# EAGLE schematic charger_v4 (EAGLE 9.6.1)
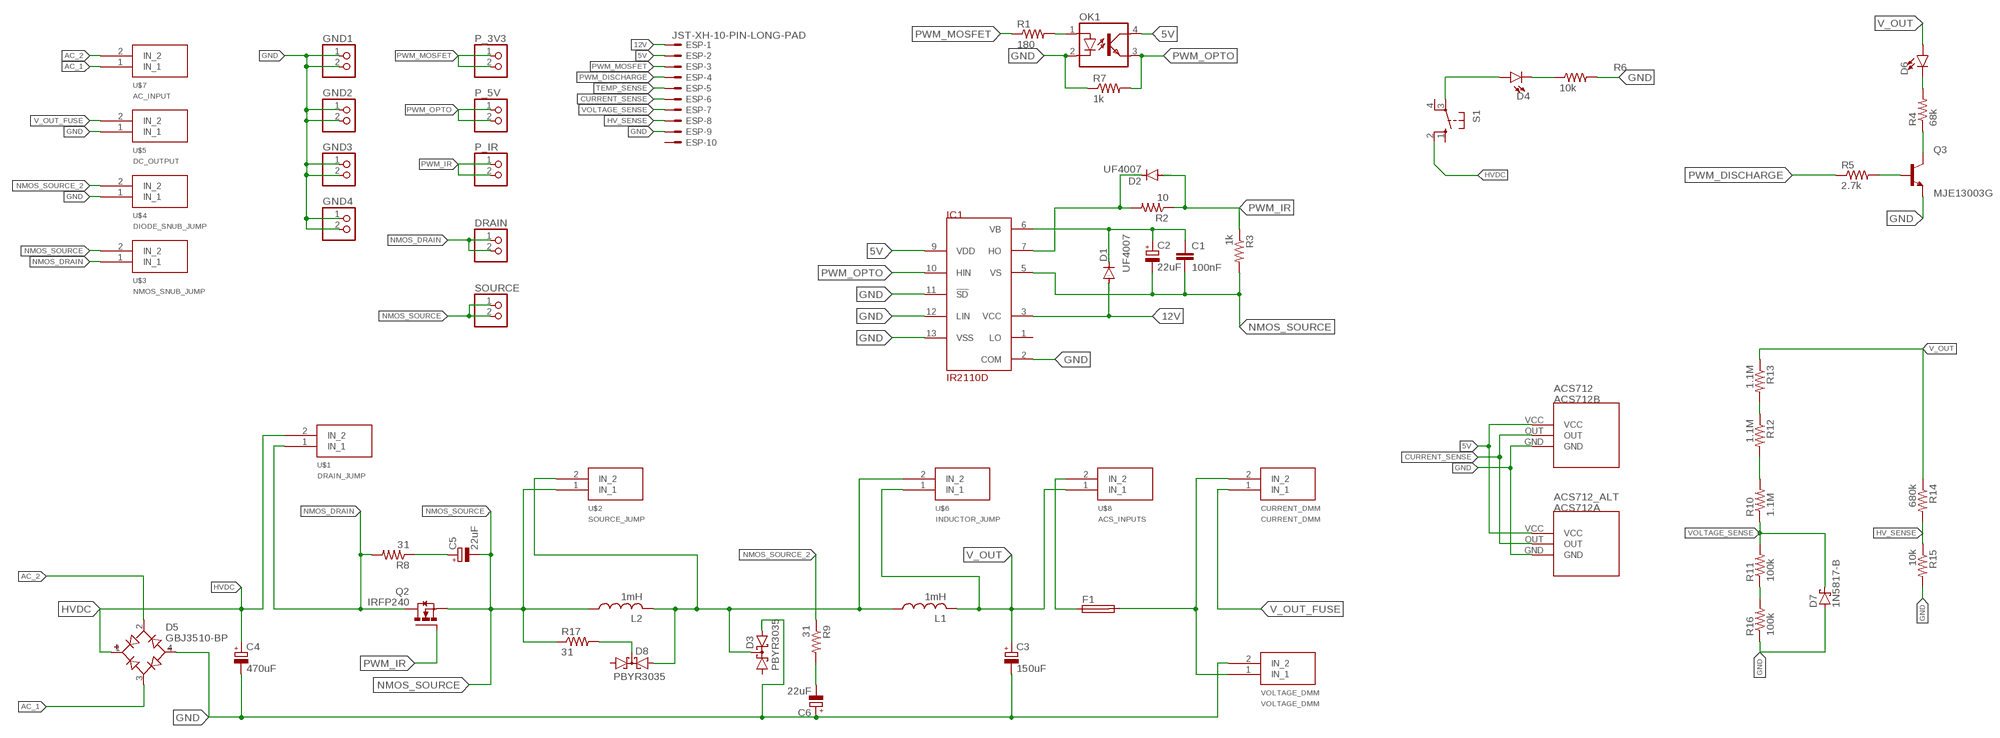
[diagram p0: schematic, sheet 1]

## Parts
ACS712  ACS712B  [ACS712-2]
ACS712_ALT  ACS712A  [ACS712-1]
C1  100nF  C-EU025-025X050  [C025-025X050]
C2  22uF  CPOL-EUE2,5-6E  [E2,5-6E]
C3  150uF  CPOL-EUE7.5-18  [E7,5-18]
C4  470uF  CPOL-EUE10-35  [EB35D]
C5  22uF  CPOL-EUETR4  [ETR4]
C6  22uF  CPOL-EUETR4  [ETR4]
CURRENT_DMM  CURRENT_DMM  TERMINAL_2P  [TERMINAL_2P]
D1  UF4007  BAS15  [DO34-7]
D2  UF4007  BAS15  [DO34-7]
D3  PBYR3035  [SOT93S]
D4  LED5MM  [LED_5MM]
D5  GBJ3510-BP  [DIOB_GBJ3510-BP]
D6  LED5MM  [LED_5MM]
D7  1N5817-B  [DO41-7.6]
D8  PBYR3035  [SOT93S]
DRAIN  PINHD-1X2  [1X02]
ESP  JST-XH-10-PIN-LONG-PAD  [JST-XH-10-PACKAGE-LONG-PAD]
F1  FUSEHOLDER  [FUSEHOLDER]
GND1  PINHD-1X2  [1X02]
GND2  PINHD-1X2  [1X02]
GND3  PINHD-1X2  [1X02]
GND4  PINHD-1X2  [1X02]
IC1  IR2110D  [DIL14]
L1  1mH  L-USTJ7-U1  [TJ7-U1]
L2  1mH  L-USTJ7-U1  [TJ7-U1]
OK1  SFH618A-5  [DIP4]
P_3V3  PINHD-1X2  [1X02]
P_5V  PINHD-1X2  [1X02]
P_IR  PINHD-1X2  [1X02]
Q2  IRFP240  [TO247AC]
Q3  MJE13003G  [TO229P780X300X1364-3]
R1  180  R-US_0204/7  [0204/7]
R2  10  R-US_0204/7  [0204/7]
R3  1k  R-US_0204/7  [0204/7]
R4  68k  R-US_0411/15  [0411/15]
R5  2.7k  R-US_0204/7  [0204/7]
R6  10k  R-US_0204/7  [0204/7]
R7  1k  R-US_0204/7  [0204/7]
R8  31  R-US_0411/15  [0411/15]
R9  31  R-US_0411/15  [0411/15]
R10  1.1M  R-US_R0805  [R0805]
R11  100k  R-US_R0805  [R0805]
R12  1.1M  R-US_R0805  [R0805]
R13  1.1M  R-US_R0805  [R0805]
R14  680k  R-US_0207/10  [0207/10]
R15  10k  R-US_0207/10  [0207/10]
R16  100k  R-US_R0805  [R0805]
R17  31  R-US_0411/15  [0411/15]
S1  10-XX  [B3F-10XX]
SOURCE  PINHD-1X2  [1X02]
U$1  DRAIN_JUMP  TERMINAL_2P  [TERMINAL_2P]
U$2  SOURCE_JUMP  TERMINAL_2P  [TERMINAL_2P]
U$3  NMOS_SNUB_JUMP  TERMINAL_2P  [TERMINAL_2P]
U$4  DIODE_SNUB_JUMP  TERMINAL_2P  [TERMINAL_2P]
U$5  DC_OUTPUT  TERMINAL_2P  [TERMINAL_2P]
U$6  INDUCTOR_JUMP  TERMINAL_2P  [TERMINAL_2P]
U$7  AC_INPUT  TERMINAL_2P  [TERMINAL_2P]
U$8  ACS_INPUTS  TERMINAL_2P  [TERMINAL_2P]
VOLTAGE_DMM  VOLTAGE_DMM  TERMINAL_2P  [TERMINAL_2P]

## Nets
5V: ACS712.VCC ACS712_ALT.VCC ESP.2 IC1.9(VDD) OK1.4(COL)
12V: D1.A ESP.1 IC1.3(VCC)
AC_1: D5.3(AC2) U$7.1(IN_1)
AC_2: D5.2(AC1) U$7.2(IN_2)
CURRENT_SENSE: ACS712.OUT ACS712_ALT.OUT ESP.6
GND: ACS712.GND ACS712_ALT.GND C3.- C4.- C6.+ D3.A2 D5.4(-) D7.A ESP.9 GND1.1 GND1.2 GND2.1 GND2.2 GND3.1 GND3.2 GND4.1 GND4.2 IC1.2(COM) IC1.11(!SD) IC1.12(LIN) IC1.13(VSS) OK1.2(C) Q3.3(E) R6.2 R7.1 R15.2 R16.1 U$4.1(IN_1) U$5.1(IN_1) VOLTAGE_DMM.2(IN_2)
HV_SENSE: ESP.8 R14.2 R15.1
HVDC: C4.+ D5.1(+) S1.2(S1) U$1.2(IN_2)
N$1: D2.C IC1.7(HO) R2.2
N$2: D4.A S1.3(P)
N$3: Q3.2(C) R4.1
N$4: D6.K(C) R4.2
N$5: Q3.1(B) R5.2
N$6: C5.+ R8.1
N$7: C6.- R9.2
N$8: D4.K(C) R6.1
N$9: OK1.1(A) R1.2
N$10: D8.C R17.2
N$11: CURRENT_DMM.2(IN_2) F1.2 VOLTAGE_DMM.1(IN_1)
N$12: R10.2 R12.2
N$13: R12.1 R13.2
N$14: R11.1 R16.2
N$15: F1.1 U$8.2(IN_2)
NMOS_DRAIN: DRAIN.1 DRAIN.2 Q2.2(D) R8.2 U$1.1(IN_1) U$3.1(IN_1)
NMOS_SOURCE: C1.2 C2.- C5.- IC1.5(VS) L2.1 Q2.3(S) R3.2 R17.1 SOURCE.1 SOURCE.2 U$2.1(IN_1) U$3.2(IN_2)
NMOS_SOURCE_2: D3.C D8.A2 L1.1 L2.2 R9.1 U$2.2(IN_2) U$4.2(IN_2) U$6.2(IN_2)
PWM_DISCHARGE: ESP.4 R5.1
PWM_IR: D2.A P_IR.1 P_IR.2 Q2.1(G) R2.1 R3.1
PWM_MOSFET: ESP.3 P_3V3.1 P_3V3.2 R1.1
PWM_OPTO: IC1.10(HIN) OK1.3(EMIT) P_5V.1 P_5V.2 R7.2
TEMP_SENSE: ESP.5
V_OUT: C3.+ D6.A L1.2 R13.1 R14.1 U$6.1(IN_1) U$8.1(IN_1)
V_OUT_FUSE: CURRENT_DMM.1(IN_1) U$5.2(IN_2)
VB: C1.1 C2.+ D1.C IC1.6(VB)
VOLTAGE_SENSE: D7.C ESP.7 R10.1 R11.2
Unconnected: D3.A1 D8.A1 ESP.10 IC1.1(LO) S1.1(S) S1.4(P1)

## Library data of the parts
ACS712 ACS712_ALT = TA_library:ACS712
C1 = rcl:C-EU: CAPACITOR, European symbol; SPICEPREFIX: C
C2-C6 = rcl:CPOL-EU: POLARIZED CAPACITOR, European symbol; SPICEPREFIX: C
CURRENT_DMM U$1-U$8 VOLTAGE_DMM = TA_library:TERMINAL_2P
D1 D2 = diode:BAS15: DIODE high speed
D3 D8 = diode:PBYR3035: Dual DIODE common cathode
D4 D6 = Sparkfun_LED:LED: LED (Generic) Standard schematic elements and footprints for 5mm, 3mm, 1206, and 0603 sized LEDs. Generic LEDs with no color specified.
D5 = GBJ3510-BP:GBJ3510-BP: Diode Rectifier Bridge Single 1KV 35A 4-Pin(4+Tab) Case GBJ Bulk/Tube Check availability <https://pricing.snapeda.com/parts/GBJ3510-BP/Micro%20Commercial/view-part?ref=eda>; AVAILABILITY: In Stock; DESCRIPTION: Bridge Rectifier Single Phase Standard 1 kV Through Hole GBJ; MF: Micro Commercial; MP: GBJ3510-BP; PACKAGE: SIP-4 Micro Commercial Co; PRICE: None; PURCHASE-URL: https://pricing.snapeda.com/search/part/GBJ3510-BP/?ref=eda
D7 = diode:1N581*: 1.0A SCHOTTKY BARRIER RECTIFIER Source: http://www.diodes.com/datasheets/ds23001.pdf
DRAIN GND1-GND4 P_3V3 P_5V P_IR SOURCE = pinhead:PINHD-1X2: PIN HEADER
ESP = Rembrandt Electronics - JST XH Connectors v1-0:JST-XH-10-PIN: JST XH Connector 2 Pin Wire to board connector. Pitch: 2,54 mm, (0.100") Number of pins: 10 Created by Rembrandt Electronics www.rembrandtelectronics.com
F1 = TA_library:FUSEHOLDER: FUSE HOLDER grid 22,5mm, isolated cap OGN0031 8201, Schurter (Buerklin); MPN: 0031.7701.11; OC_FARNELL: unknown; OC_NEWARK: 04F1224
IC1 = irs:IR2110
L1 L2 = custom_inductor:L-US: INDUCTOR, American symbol; SPICEPREFIX: L
OK1 = optocoupler:SFH618?*: Optocoupler, Phototransistor Output, Low Input Current Source: Data sheet <http://www.vishay.com/docs/83673/sfh618.pdf>; MF: VISHAY/TELEFUNKEN; MPN: SFH618A-5; OC_FARNELL: 1469593; OC_NEWARK: 59K0259
Q2 = IRFP240(TO-247):IRFP240: MOSFET N-CH 200V 20A TO-247AC Check availability <https://pricing.snapeda.com/parts/IRFP240/Vishay%20Siliconix/view-part?ref=eda>; AVAILABILITY: In Stock; DESCRIPTION: N-Channel 200 V 20A (Tc) 150W (Tc) Through Hole TO-247AC; MF: Vishay Siliconix; MP: IRFP240; PACKAGE: TO-247 Vishay Siliconix; PRICE: None
Q3 = MJE13003G:MJE13003G: Bipolar (BJT) Transistor NPN 400V 1.5A 10MHz 1.4W Through Hole TO-225AA Check availability <https://pricing.snapeda.com/parts/MJE13003G/ON%20Semiconductor/view-part?ref=eda>; AVAILABILITY: Not in stock; DESCRIPTION: Bipolar (BJT) Transistor NPN 400 V 1.5 A 10MHz 1.4 W Through Hole TO-126; MF: ON Semiconductor; MP: MJE13003G; PACKAGE: TO-126 ON Semiconductor; PRICE: None
R1-R17 = rcl:R-US_: RESISTOR, American symbol; SPICEPREFIX: R
S1 = switch-omron:10-XX: OMRON SWITCH; MPN: B3F-1000; OC_FARNELL: 176432; OC_NEWARK: 36M3542

## Net classes
0 default: width 0.305 mm
1 power: width 6.985 mm, clearance 0.508 mm to class 0
2 pwm_12: width 0.305 mm, clearance 0.508 mm to class 0, clearance 0.508 mm to class 1